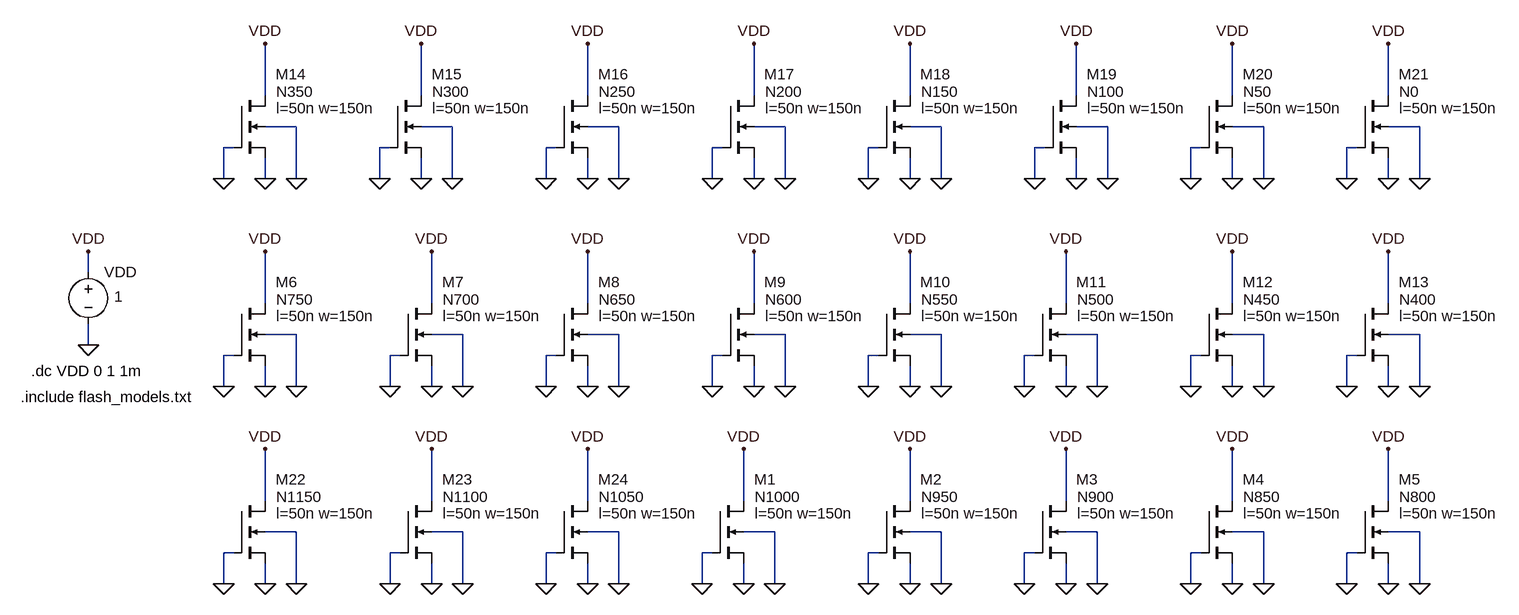
[diagram p0: schematic Flash_cells.asc]
Flash_cells.asc, the LTspice schematic file:
Version 4
SHEET 1 2620 680
WIRE 704 -1792 704 -1872
WIRE 944 -1792 944 -1872
WIRE 1200 -1792 1200 -1872
WIRE 1456 -1792 1456 -1872
WIRE 1696 -1792 1696 -1872
WIRE 1952 -1792 1952 -1872
WIRE 2192 -1792 2192 -1872
WIRE 2432 -1792 2432 -1872
WIRE 752 -1744 704 -1744
WIRE 992 -1744 944 -1744
WIRE 1248 -1744 1200 -1744
WIRE 1504 -1744 1456 -1744
WIRE 1744 -1744 1696 -1744
WIRE 2000 -1744 1952 -1744
WIRE 2240 -1744 2192 -1744
WIRE 2480 -1744 2432 -1744
WIRE 656 -1712 640 -1712
WIRE 896 -1712 880 -1712
WIRE 1152 -1712 1136 -1712
WIRE 1408 -1712 1392 -1712
WIRE 1648 -1712 1632 -1712
WIRE 1904 -1712 1888 -1712
WIRE 2144 -1712 2128 -1712
WIRE 2384 -1712 2368 -1712
WIRE 640 -1664 640 -1712
WIRE 704 -1664 704 -1696
WIRE 752 -1664 752 -1744
WIRE 880 -1664 880 -1712
WIRE 944 -1664 944 -1696
WIRE 992 -1664 992 -1744
WIRE 1136 -1664 1136 -1712
WIRE 1200 -1664 1200 -1696
WIRE 1248 -1664 1248 -1744
WIRE 1392 -1664 1392 -1712
WIRE 1456 -1664 1456 -1696
WIRE 1504 -1664 1504 -1744
WIRE 1632 -1664 1632 -1712
WIRE 1696 -1664 1696 -1696
WIRE 1744 -1664 1744 -1744
WIRE 1888 -1664 1888 -1712
WIRE 1952 -1664 1952 -1696
WIRE 2000 -1664 2000 -1744
WIRE 2128 -1664 2128 -1712
WIRE 2192 -1664 2192 -1696
WIRE 2240 -1664 2240 -1744
WIRE 2368 -1664 2368 -1712
WIRE 2432 -1664 2432 -1696
WIRE 2480 -1664 2480 -1744
WIRE 432 -1520 432 -1552
WIRE 704 -1472 704 -1552
WIRE 960 -1472 960 -1552
WIRE 1200 -1472 1200 -1552
WIRE 1456 -1472 1456 -1552
WIRE 1696 -1472 1696 -1552
WIRE 1936 -1472 1936 -1552
WIRE 2192 -1472 2192 -1552
WIRE 2432 -1472 2432 -1552
WIRE 752 -1424 704 -1424
WIRE 1008 -1424 960 -1424
WIRE 1248 -1424 1200 -1424
WIRE 1504 -1424 1456 -1424
WIRE 1744 -1424 1696 -1424
WIRE 1984 -1424 1936 -1424
WIRE 2240 -1424 2192 -1424
WIRE 2480 -1424 2432 -1424
WIRE 432 -1408 432 -1440
WIRE 656 -1392 640 -1392
WIRE 912 -1392 896 -1392
WIRE 1152 -1392 1136 -1392
WIRE 1408 -1392 1392 -1392
WIRE 1648 -1392 1632 -1392
WIRE 1888 -1392 1872 -1392
WIRE 2144 -1392 2128 -1392
WIRE 2384 -1392 2368 -1392
WIRE 640 -1344 640 -1392
WIRE 704 -1344 704 -1376
WIRE 752 -1344 752 -1424
WIRE 896 -1344 896 -1392
WIRE 960 -1344 960 -1376
WIRE 1008 -1344 1008 -1424
WIRE 1136 -1344 1136 -1392
WIRE 1200 -1344 1200 -1376
WIRE 1248 -1344 1248 -1424
WIRE 1392 -1344 1392 -1392
WIRE 1456 -1344 1456 -1376
WIRE 1504 -1344 1504 -1424
WIRE 1632 -1344 1632 -1392
WIRE 1696 -1344 1696 -1376
WIRE 1744 -1344 1744 -1424
WIRE 1872 -1344 1872 -1392
WIRE 1936 -1344 1936 -1376
WIRE 1984 -1344 1984 -1424
WIRE 2128 -1344 2128 -1392
WIRE 2192 -1344 2192 -1376
WIRE 2240 -1344 2240 -1424
WIRE 2368 -1344 2368 -1392
WIRE 2432 -1344 2432 -1376
WIRE 2480 -1344 2480 -1424
WIRE 704 -1168 704 -1248
WIRE 960 -1168 960 -1248
WIRE 1200 -1168 1200 -1248
WIRE 1440 -1168 1440 -1248
WIRE 1696 -1168 1696 -1248
WIRE 1936 -1168 1936 -1248
WIRE 2192 -1168 2192 -1248
WIRE 2432 -1168 2432 -1248
WIRE 752 -1120 704 -1120
WIRE 1008 -1120 960 -1120
WIRE 1248 -1120 1200 -1120
WIRE 1488 -1120 1440 -1120
WIRE 1744 -1120 1696 -1120
WIRE 1984 -1120 1936 -1120
WIRE 2240 -1120 2192 -1120
WIRE 2480 -1120 2432 -1120
WIRE 656 -1088 640 -1088
WIRE 912 -1088 896 -1088
WIRE 1152 -1088 1136 -1088
WIRE 1392 -1088 1376 -1088
WIRE 1648 -1088 1632 -1088
WIRE 1888 -1088 1872 -1088
WIRE 2144 -1088 2128 -1088
WIRE 2384 -1088 2368 -1088
WIRE 640 -1040 640 -1088
WIRE 704 -1040 704 -1072
WIRE 752 -1040 752 -1120
WIRE 896 -1040 896 -1088
WIRE 960 -1040 960 -1072
WIRE 1008 -1040 1008 -1120
WIRE 1136 -1040 1136 -1088
WIRE 1200 -1040 1200 -1072
WIRE 1248 -1040 1248 -1120
WIRE 1376 -1040 1376 -1088
WIRE 1440 -1040 1440 -1072
WIRE 1488 -1040 1488 -1120
WIRE 1632 -1040 1632 -1088
WIRE 1696 -1040 1696 -1072
WIRE 1744 -1040 1744 -1120
WIRE 1872 -1040 1872 -1088
WIRE 1936 -1040 1936 -1072
WIRE 1984 -1040 1984 -1120
WIRE 2128 -1040 2128 -1088
WIRE 2192 -1040 2192 -1072
WIRE 2240 -1040 2240 -1120
WIRE 2368 -1040 2368 -1088
WIRE 2432 -1040 2432 -1072
WIRE 2480 -1040 2480 -1120
FLAG 432 -1408 0
FLAG 432 -1552 VDD
FLAG 1440 -1040 0
FLAG 1376 -1040 0
FLAG 1488 -1040 0
FLAG 1440 -1248 VDD
FLAG 1696 -1040 0
FLAG 1632 -1040 0
FLAG 1744 -1040 0
FLAG 1696 -1248 VDD
FLAG 1936 -1040 0
FLAG 1872 -1040 0
FLAG 1984 -1040 0
FLAG 1936 -1248 VDD
FLAG 2192 -1040 0
FLAG 2128 -1040 0
FLAG 2240 -1040 0
FLAG 2192 -1248 VDD
FLAG 2432 -1040 0
FLAG 2368 -1040 0
FLAG 2480 -1040 0
FLAG 2432 -1248 VDD
FLAG 704 -1344 0
FLAG 640 -1344 0
FLAG 752 -1344 0
FLAG 704 -1552 VDD
FLAG 960 -1344 0
FLAG 896 -1344 0
FLAG 1008 -1344 0
FLAG 960 -1552 VDD
FLAG 1200 -1344 0
FLAG 1136 -1344 0
FLAG 1248 -1344 0
FLAG 1200 -1552 VDD
FLAG 1456 -1344 0
FLAG 1392 -1344 0
FLAG 1504 -1344 0
FLAG 1456 -1552 VDD
FLAG 1696 -1344 0
FLAG 1632 -1344 0
FLAG 1744 -1344 0
FLAG 1696 -1552 VDD
FLAG 1936 -1344 0
FLAG 1872 -1344 0
FLAG 1984 -1344 0
FLAG 1936 -1552 VDD
FLAG 2192 -1344 0
FLAG 2128 -1344 0
FLAG 2240 -1344 0
FLAG 2192 -1552 VDD
FLAG 2432 -1344 0
FLAG 2368 -1344 0
FLAG 2480 -1344 0
FLAG 2432 -1552 VDD
FLAG 704 -1664 0
FLAG 640 -1664 0
FLAG 752 -1664 0
FLAG 704 -1872 VDD
FLAG 944 -1664 0
FLAG 880 -1664 0
FLAG 992 -1664 0
FLAG 944 -1872 VDD
FLAG 1200 -1664 0
FLAG 1136 -1664 0
FLAG 1248 -1664 0
FLAG 1200 -1872 VDD
FLAG 1456 -1664 0
FLAG 1392 -1664 0
FLAG 1504 -1664 0
FLAG 1456 -1872 VDD
FLAG 1696 -1664 0
FLAG 1632 -1664 0
FLAG 1744 -1664 0
FLAG 1696 -1872 VDD
FLAG 1952 -1664 0
FLAG 1888 -1664 0
FLAG 2000 -1664 0
FLAG 1952 -1872 VDD
FLAG 2192 -1664 0
FLAG 2128 -1664 0
FLAG 2240 -1664 0
FLAG 2192 -1872 VDD
FLAG 2432 -1664 0
FLAG 2368 -1664 0
FLAG 2480 -1664 0
FLAG 2432 -1872 VDD
FLAG 704 -1040 0
FLAG 640 -1040 0
FLAG 752 -1040 0
FLAG 704 -1248 VDD
FLAG 960 -1040 0
FLAG 896 -1040 0
FLAG 1008 -1040 0
FLAG 960 -1248 VDD
FLAG 1200 -1040 0
FLAG 1136 -1040 0
FLAG 1248 -1040 0
FLAG 1200 -1248 VDD
SYMBOL voltage 432 -1536 R0
WINDOW 123 0 0 Left 0
WINDOW 39 0 0 Left 0
WINDOW 3 40 53 Left 0
SYMATTR Value 1
SYMATTR InstName VDD
SYMBOL nmos4 1392 -1168 R0
WINDOW 0 64 -33 Left 0
WINDOW 3 65 -6 Left 0
WINDOW 123 65 19 Left 0
SYMATTR InstName M1
SYMATTR Value N1000
SYMATTR Value2 l=50n w=150n
SYMBOL nmos4 1648 -1168 R0
WINDOW 0 64 -33 Left 0
WINDOW 3 65 -6 Left 0
WINDOW 123 65 19 Left 0
SYMATTR InstName M2
SYMATTR Value N950
SYMATTR Value2 l=50n w=150n
SYMBOL nmos4 1888 -1168 R0
WINDOW 0 64 -33 Left 0
WINDOW 3 65 -6 Left 0
WINDOW 123 65 19 Left 0
SYMATTR InstName M3
SYMATTR Value N900
SYMATTR Value2 l=50n w=150n
SYMBOL nmos4 2144 -1168 R0
WINDOW 0 64 -33 Left 0
WINDOW 3 65 -6 Left 0
WINDOW 123 65 19 Left 0
SYMATTR InstName M4
SYMATTR Value N850
SYMATTR Value2 l=50n w=150n
SYMBOL nmos4 2384 -1168 R0
WINDOW 0 64 -33 Left 0
WINDOW 3 65 -6 Left 0
WINDOW 123 65 19 Left 0
SYMATTR InstName M5
SYMATTR Value N800
SYMATTR Value2 l=50n w=150n
SYMBOL nmos4 656 -1472 R0
WINDOW 0 64 -33 Left 0
WINDOW 3 65 -6 Left 0
WINDOW 123 65 19 Left 0
SYMATTR InstName M6
SYMATTR Value N750
SYMATTR Value2 l=50n w=150n
SYMBOL nmos4 912 -1472 R0
WINDOW 0 64 -33 Left 0
WINDOW 3 65 -6 Left 0
WINDOW 123 65 19 Left 0
SYMATTR InstName M7
SYMATTR Value N700
SYMATTR Value2 l=50n w=150n
SYMBOL nmos4 1152 -1472 R0
WINDOW 0 64 -33 Left 0
WINDOW 3 65 -6 Left 0
WINDOW 123 65 19 Left 0
SYMATTR InstName M8
SYMATTR Value N650
SYMATTR Value2 l=50n w=150n
SYMBOL nmos4 1408 -1472 R0
WINDOW 0 64 -33 Left 0
WINDOW 3 65 -6 Left 0
WINDOW 123 65 19 Left 0
SYMATTR InstName M9
SYMATTR Value N600
SYMATTR Value2 l=50n w=150n
SYMBOL nmos4 1648 -1472 R0
WINDOW 0 64 -33 Left 0
WINDOW 3 65 -6 Left 0
WINDOW 123 65 19 Left 0
SYMATTR InstName M10
SYMATTR Value N550
SYMATTR Value2 l=50n w=150n
SYMBOL nmos4 1888 -1472 R0
WINDOW 0 64 -33 Left 0
WINDOW 3 65 -6 Left 0
WINDOW 123 65 19 Left 0
SYMATTR InstName M11
SYMATTR Value N500
SYMATTR Value2 l=50n w=150n
SYMBOL nmos4 2144 -1472 R0
WINDOW 0 64 -33 Left 0
WINDOW 3 65 -6 Left 0
WINDOW 123 65 19 Left 0
SYMATTR InstName M12
SYMATTR Value N450
SYMATTR Value2 l=50n w=150n
SYMBOL nmos4 2384 -1472 R0
WINDOW 0 64 -33 Left 0
WINDOW 3 65 -6 Left 0
WINDOW 123 65 19 Left 0
SYMATTR InstName M13
SYMATTR Value N400
SYMATTR Value2 l=50n w=150n
SYMBOL nmos4 656 -1792 R0
WINDOW 0 64 -33 Left 0
WINDOW 3 65 -6 Left 0
WINDOW 123 65 19 Left 0
SYMATTR InstName M14
SYMATTR Value N350
SYMATTR Value2 l=50n w=150n
SYMBOL nmos4 896 -1792 R0
WINDOW 0 64 -33 Left 0
WINDOW 3 65 -6 Left 0
WINDOW 123 65 19 Left 0
SYMATTR InstName M15
SYMATTR Value N300
SYMATTR Value2 l=50n w=150n
SYMBOL nmos4 1152 -1792 R0
WINDOW 0 64 -33 Left 0
WINDOW 3 65 -6 Left 0
WINDOW 123 65 19 Left 0
SYMATTR InstName M16
SYMATTR Value N250
SYMATTR Value2 l=50n w=150n
SYMBOL nmos4 1408 -1792 R0
WINDOW 0 64 -33 Left 0
WINDOW 3 65 -6 Left 0
WINDOW 123 65 19 Left 0
SYMATTR InstName M17
SYMATTR Value N200
SYMATTR Value2 l=50n w=150n
SYMBOL nmos4 1648 -1792 R0
WINDOW 0 64 -33 Left 0
WINDOW 3 65 -6 Left 0
WINDOW 123 65 19 Left 0
SYMATTR InstName M18
SYMATTR Value N150
SYMATTR Value2 l=50n w=150n
SYMBOL nmos4 1904 -1792 R0
WINDOW 0 64 -33 Left 0
WINDOW 3 65 -6 Left 0
WINDOW 123 65 19 Left 0
SYMATTR InstName M19
SYMATTR Value N100
SYMATTR Value2 l=50n w=150n
SYMBOL nmos4 2144 -1792 R0
WINDOW 0 64 -33 Left 0
WINDOW 3 65 -6 Left 0
WINDOW 123 65 19 Left 0
SYMATTR InstName M20
SYMATTR Value N50
SYMATTR Value2 l=50n w=150n
SYMBOL nmos4 2384 -1792 R0
WINDOW 0 64 -33 Left 0
WINDOW 3 65 -6 Left 0
WINDOW 123 65 19 Left 0
SYMATTR InstName M21
SYMATTR Value N0
SYMATTR Value2 l=50n w=150n
SYMBOL nmos4 656 -1168 R0
WINDOW 0 64 -33 Left 0
WINDOW 3 65 -6 Left 0
WINDOW 123 65 19 Left 0
SYMATTR InstName M22
SYMATTR Value N1150
SYMATTR Value2 l=50n w=150n
SYMBOL nmos4 912 -1168 R0
WINDOW 0 64 -33 Left 0
WINDOW 3 65 -6 Left 0
WINDOW 123 65 19 Left 0
SYMATTR InstName M23
SYMATTR Value N1100
SYMATTR Value2 l=50n w=150n
SYMBOL nmos4 1152 -1168 R0
WINDOW 0 64 -33 Left 0
WINDOW 3 65 -6 Left 0
WINDOW 123 65 19 Left 0
SYMATTR InstName M24
SYMATTR Value N1050
SYMATTR Value2 l=50n w=150n
TEXT 328 -1328 Left 0 !.include flash_models.txt
TEXT 344 -1368 Left 0 !.dc VDD 0 1 1m

The netlist it stands for:
* Flash_cells.asc
VDD VDD 0 1
M1 VDD 0 0 0 N1000 l=50n w=150n
M2 VDD 0 0 0 N950 l=50n w=150n
M3 VDD 0 0 0 N900 l=50n w=150n
M4 VDD 0 0 0 N850 l=50n w=150n
M5 VDD 0 0 0 N800 l=50n w=150n
M6 VDD 0 0 0 N750 l=50n w=150n
M7 VDD 0 0 0 N700 l=50n w=150n
M8 VDD 0 0 0 N650 l=50n w=150n
M9 VDD 0 0 0 N600 l=50n w=150n
M10 VDD 0 0 0 N550 l=50n w=150n
M11 VDD 0 0 0 N500 l=50n w=150n
M12 VDD 0 0 0 N450 l=50n w=150n
M13 VDD 0 0 0 N400 l=50n w=150n
M14 VDD 0 0 0 N350 l=50n w=150n
M15 VDD 0 0 0 N300 l=50n w=150n
M16 VDD 0 0 0 N250 l=50n w=150n
M17 VDD 0 0 0 N200 l=50n w=150n
M18 VDD 0 0 0 N150 l=50n w=150n
M19 VDD 0 0 0 N100 l=50n w=150n
M20 VDD 0 0 0 N50 l=50n w=150n
M21 VDD 0 0 0 N0 l=50n w=150n
M22 VDD 0 0 0 N1150 l=50n w=150n
M23 VDD 0 0 0 N1100 l=50n w=150n
M24 VDD 0 0 0 N1050 l=50n w=150n
.model NMOS NMOS
.model PMOS PMOS
.lib standard.mos
.include flash_models.txt
.dc VDD 0 1 1m
.backanno
.end